# EAGLE design main (EAGLE 7.4.0)
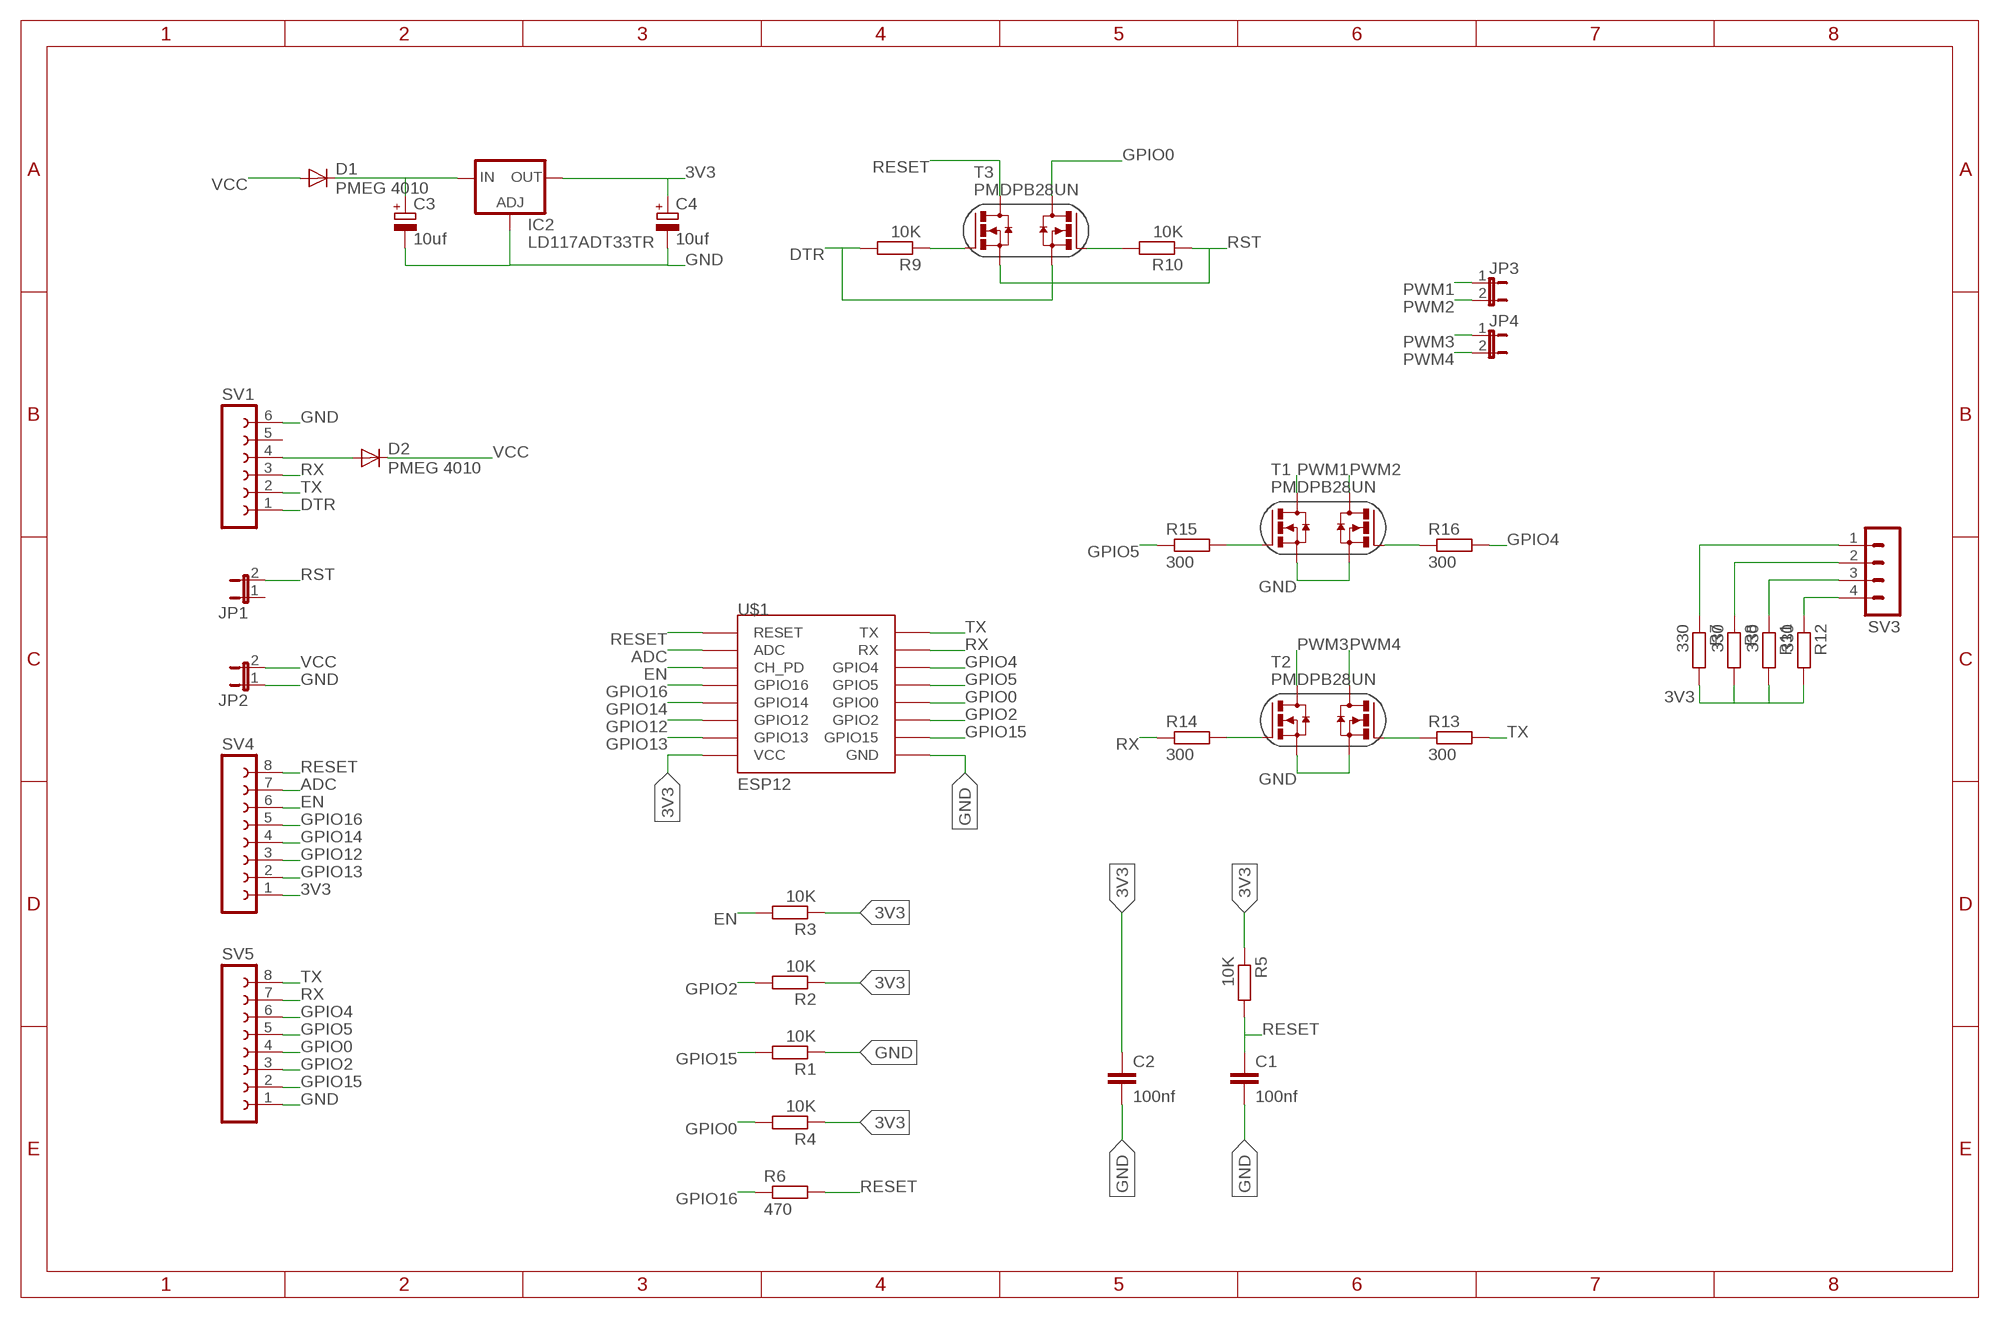
[diagram p0: schematic, sheet 1]

## Parts
C1  100nf  C-EUC0805K  [C0805K]
C2  100nf  C-EUC0805K  [C0805K]
C3  10uf  CPOL-EUSMCB  [SMC_B]
C4  10uf  CPOL-EUSMCB  [SMC_B]
D1  PMEG 4010  DIODESOD  [SOD-323]
D2  PMEG 4010  DIODESOD  [SOD-323]
IC2  LD117ADT33TR  [DPACK]
JP1  JUMPER-2PTH  [1X02]
JP2  JUMPER-2PTH  [1X02]
JP3  JUMPER-2PTH  [1X02]
JP4  JUMPER-2PTH  [1X02]
R1  10K  R-EU_R1206  [R1206]
R2  10K  R-EU_R1206  [R1206]
R3  10K  R-EU_R1206  [R1206]
R4  10K  R-EU_R1206  [R1206]
R5  10K  R-EU_R1206  [R1206]
R6  470  R-EU_R1206  [R1206]
R7  330  R-EU_R1206  [R1206]
R8  330  R-EU_R1206  [R1206]
R9  10K  R-EU_R1206  [R1206]
R10  10K  R-EU_R1206  [R1206]
R11  330  R-EU_R1206  [R1206]
R12  330  R-EU_R1206  [R1206]
R13  300  R-EU_R1206  [R1206]
R14  300  R-EU_R1206  [R1206]
R15  300  R-EU_R1206  [R1206]
R16  300  R-EU_R1206  [R1206]
SV1  FE06-1  [FE06]
SV3  MA04-1  [MA04-1]
SV4  FE08-1  [FE08]
SV5  FE08-1  [FE08]
T1  PMDPB28UN  [SOT1118]
T2  PMDPB28UN  [SOT1118]
T3  PMDPB28UN  [SOT1118]
U$1  ESP12  [ESP12]

## Nets
3V3: C2.1 C4.+ IC2.4(OUT) R2.1 R3.1 R4.1 R5.1 R7.2 R8.2 R11.2 R12.2 SV4.1 U$1.VCC
ADC: SV4.7 U$1.ADC
DTR: R9.2 SV1.1 T3.S2
EN: R3.2 SV4.6 U$1.CH_PD
GND: C1.2 C2.2 C3.- C4.- IC2.1(ADJ) JP2.1 R1.1 SV1.6 SV5.1 T1.S1 T1.S2 T2.S1 T2.S2 U$1.GND
GPIO0: R4.2 SV5.4 T3.D2 T3.D22(D2) U$1.GPIO0
GPIO2: R2.2 SV5.3 U$1.GPIO2
GPIO4: R16.2 SV5.6 U$1.GPIO4
GPIO5: R15.1 SV5.5 U$1.GPIO5
GPIO12: SV4.3 U$1.GPIO12
GPIO13: SV4.2 U$1.GPIO13
GPIO14: SV4.4 U$1.GPIO14
GPIO15: R1.2 SV5.2 U$1.GPIO15
GPIO16: R6.1 SV4.5 U$1.GPIO16
N$1: R15.2 T1.G1
N$2: R16.1 T1.G2
N$3: R9.1 T3.G1
N$4: R10.2 T3.G2
N$5: R14.2 T2.G1
N$6: R13.1 T2.G2
N$7: D2.2(A) SV1.4
N$11: R12.1 SV3.4
N$12: R11.1 SV3.3
N$13: R8.1 SV3.2
N$14: R7.1 SV3.1
PWM1: JP3.1 T1.D1 T1.D11(D1)
PWM2: JP3.2 T1.D2 T1.D22(D2)
PWM3: JP4.1 T2.D1 T2.D11(D1)
PWM4: JP4.2 T2.D2 T2.D22(D2)
RESET: C1.1 R5.2 R6.2 SV4.8 T3.D1 T3.D11(D1) U$1.RESET
RST: JP1.2 R10.1 T3.S1
RX: R14.1 SV1.3 SV5.7 U$1.RX
TX: R13.2 SV1.2 SV5.8 U$1.TX
VCC: C3.+ D1.1(C) D1.2(A) D2.1(C) IC2.3(IN) JP2.2
Unconnected: JP1.1 SV1.5

## Library data of the parts
C1 C2 = rcl:C-EU: CAPACITOR, European symbol
C3 C4 = rcl:CPOL-EU: POLARIZED CAPACITOR, European symbol
D1 D2 = SparkFun:DIODE: Diode These are standard reverse protection diodes and small signal diodes. SMA package can handle up to about 1A. SOD-323 can handle about 200mA. What the SOD-323 package when ordering, there are some mfgs out there that are 5-pin packages.
IC2 = v-reg:LD117A?*: Low drop fixed and adjustable positive voltage regulators 1 A Source: http://www.st.com/stonline/products/literature/ds/7194/ld1117axx.pdf
JP1-JP4 = SparkFun:JUMPER-2: Jumper Basic 0.1" spaced jumper. Use with breakaway headers.
R1-R16 = resistor:R-EU_: RESISTOR, European symbol
SV1 = con-lsta:FE06-1: FEMALE HEADER; OC_FARNELL: unknown; OC_NEWARK: unknown
SV3 = con-lstb:MA04-1: PIN HEADER; OC_FARNELL: unknown; OC_NEWARK: unknown
SV4 SV5 = con-lsta:FE08-1: FEMALE HEADER; OC_FARNELL: unknown; OC_NEWARK: unknown
T1-T3 = ArmiT Comps:PMDPB28UN: PMDPB28UN 20 V, dual N-channel Trench MOSFET Dual N-channel enhancement mode Field-Effect Transistor (FET) in a small and leadless ultra thin DFN2020-6 (SOT1118) Surface-Mounted Device (SMD) plastic package using Trench MOSFET technology.
U$1 = esp8266modules:ESP12: ESP8266 Wifi module 12

## Board
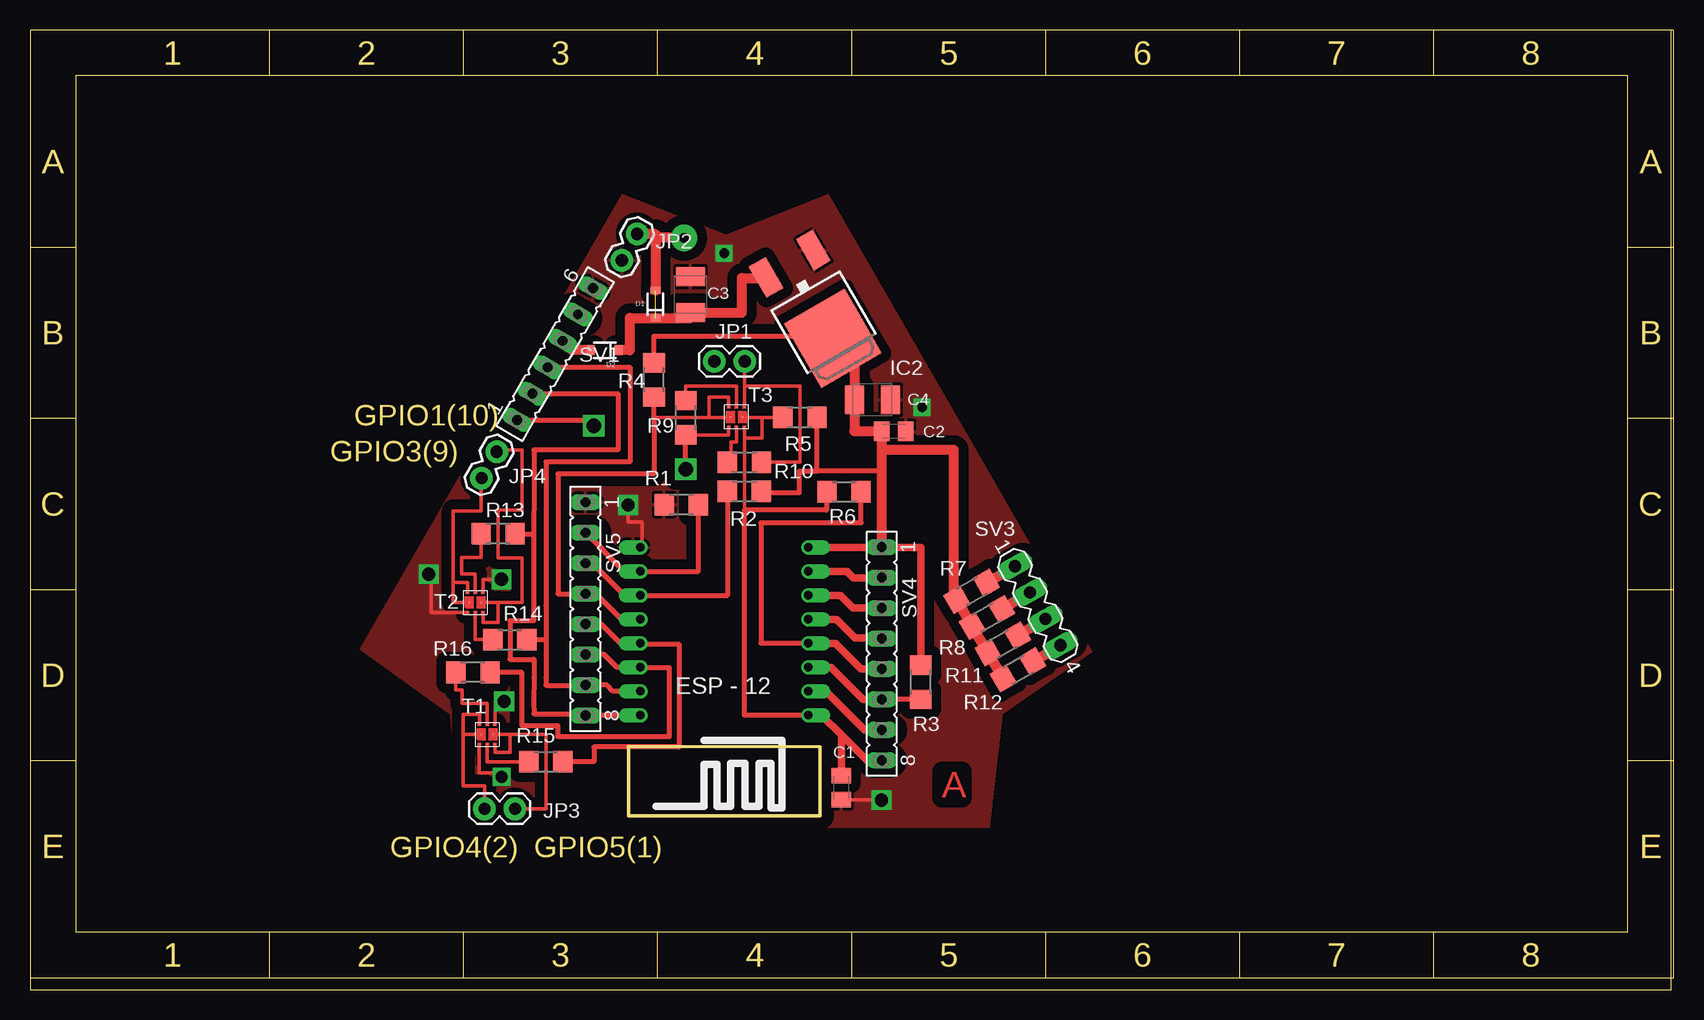
[diagram p1: board, top side]
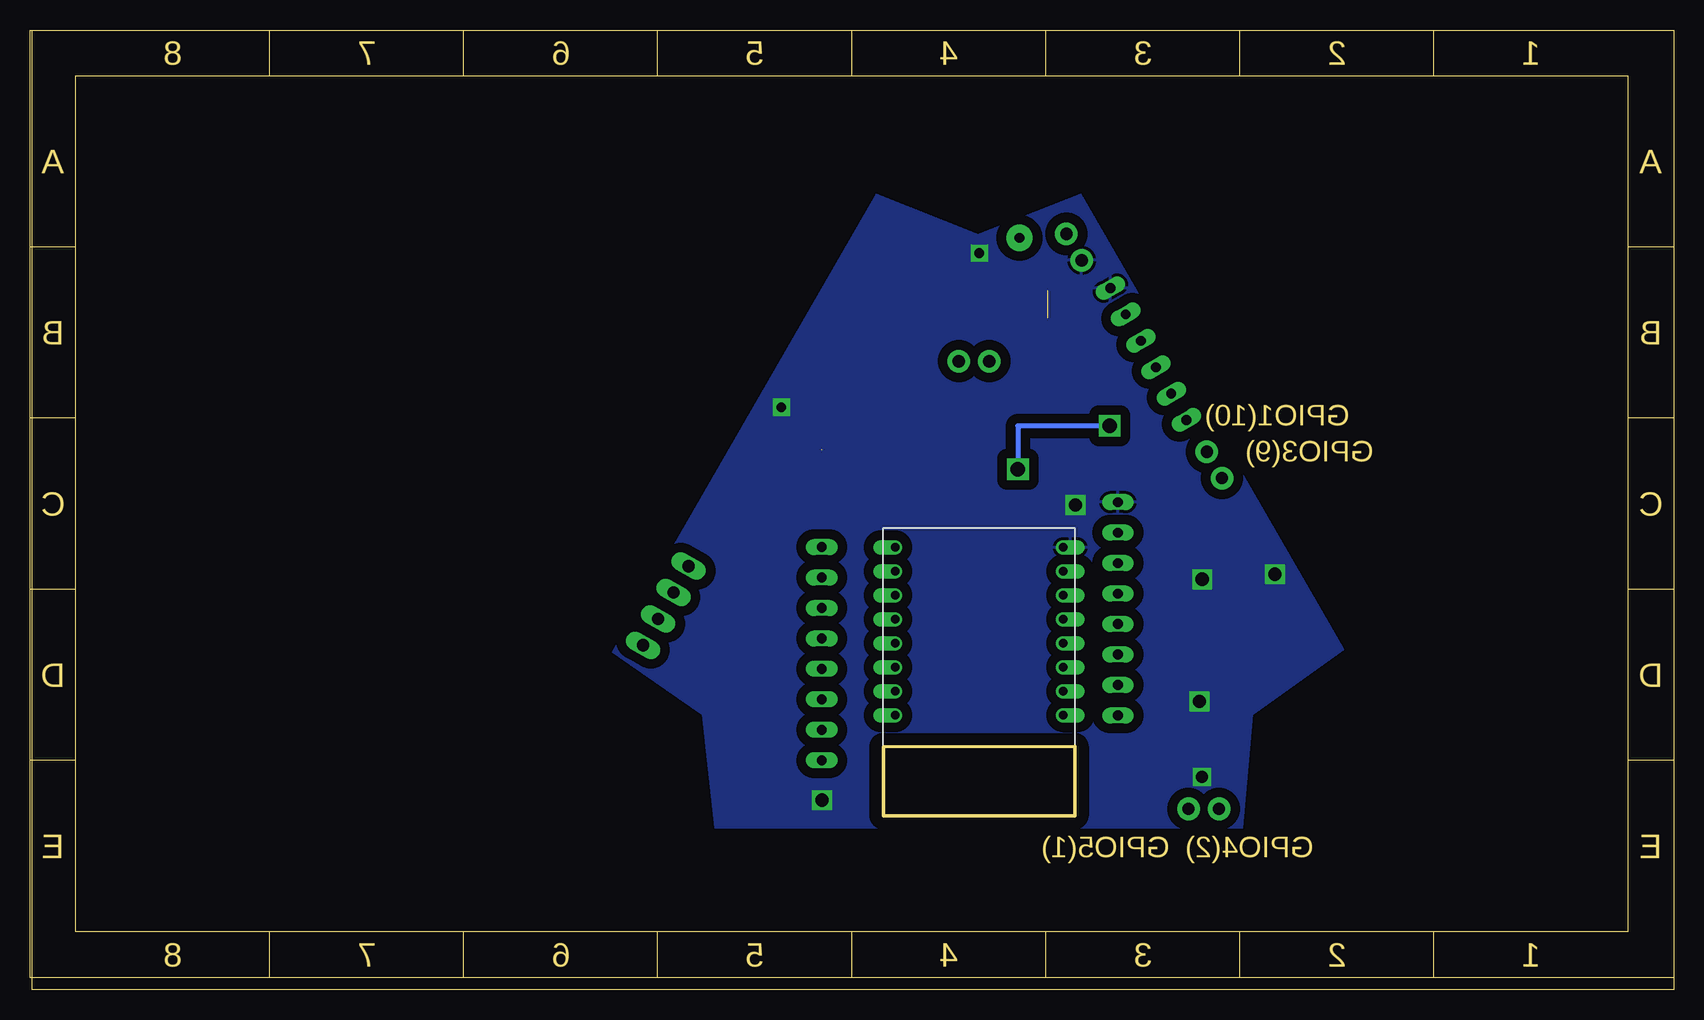
[diagram p2: board, bottom side, seen from below]

Size 137 x 80 mm. Coordinates in mm from the lower left corner, seen from the top.
Outline: 0,0 136.83,0 136.83,80 0,80 0,0
Copper layers (1*16): Top 0.035mm / dielectric 1.5mm / Bottom 0.035mm
Design rules "default": minimum track width 10mil, minimum drill 24mil, track to track 8mil, track to pad 8mil, pad to pad 8mil, via to via 8mil, smd to smd 8mil, copper to edge 40mil, drill to drill 8mil, minimum pad ring 10mil, minimum via ring 8mil, stop-mask expansion 4mil, vias tented up to drill 0mil, thermal gap 10mil

### Footprints (pad centres in the part's own frame; a part is rotated, then mirrored left to right if it is on the bottom)
C0805K = smd 1.3 x 1.6: 1 -1,0; 2 1,0
SMC_B = smd 1.6 x 2.4: + -1.5,0; - 1.5,0
SOD-323 = smd 0.63 x 0.83: 1 -1.15,0; 2 1.15,0
DPACK = smd 1.6 x 3: 1 -2.28,-4.8; 3 2.28,-4.8 | smd 5.8 x 6.2: 4 0,2.38
1X02 = drill 1.016 pad 1.88: 1 0,0; 2 2.54,0
R1206 = smd 1.6 x 1.803: 1 -1.422,0; 2 1.422,0
FE06 = drill 0.813 long: 1 -6.35,0; 2 -3.81,0; 3 -1.27,0; 4 1.27,0; 5 3.81,0; 6 6.35,0
MA04-1 = drill 1.016 long: 1 -3.81,0; 2 -1.27,0; 3 1.27,0; 4 3.81,0
FE08 = drill 0.813 long: 1 -8.89,0; 2 -6.35,0; 3 -3.81,0; 4 -1.27,0; 5 1.27,0; 6 3.81,0; 7 6.35,0; 8 8.89,0
SOT1118 = smd 0.127 x 0.076: D1 -0.546,1.105; D2 0.762,-0.572; D11 -0.386,0.279; D22 0.622,0.279; G1 0.102,-0.572; G2 0.102,1.118; S1 -0.546,-0.572; S2 0.762,1.105
ESP12 = drill 0.7 offset: ADC -7.1,3.8; CH_PD -7.1,1.8; GND 6.9,-8.2; GPIO0 6.9,-2.2; GPIO2 6.9,-4.2; GPIO4 6.9,1.8; GPIO5 6.9,-0.2; GPIO12 -7.1,-4.2; GPIO13 -7.1,-6.2; GPIO14 -7.1,-2.2; GPIO15 6.9,-6.2; GPIO16 -7.1,-0.2; RESET -7.1,5.8; RX 6.9,3.8; TX 6.9,5.8; VCC -7.1,-8.2

### Placement (x,y rotation side)
C1  67.63,16.83 270 top
C2  72.01,46.54 0 top
C3  55.07,57.94 90 top
C4  70.22,49.17 0 top
D1  52.14,57.14 90 top
D2  47.91,53.3 180 top
IC2  65.73,56.35 210 top
JP1  57.04,52.38 0 top
JP2  49.34,60.8 60 top
JP3  37.89,15.06 0 top
JP4  37.63,42.63 60 top
R1  54.29,40.43 0 top
R2  59.54,41.54 180 top
R3  74.26,25.62 270 top
R4  52.02,50.83 270 top
R5  64.18,47.7 180 top
R6  67.85,41.51 180 top
R7  78.5,33.2 210 top
R8  79.77,31.02 210 top
R9  54.66,47.68 270 top
R10  59.55,43.96 180 top
R11  81.08,28.81 210 top
R12  82.36,26.65 210 top
R13  39.02,38 0 top
R14  40,29.17 180 top
R15  43,19 180 top
R16  36.92,26.44 0 top
SV1  43.77,52.98 60 top
SV3  84,32 300 top
SV4  71,28 270 top
SV5  46.31,31.74 270 top
T1  38,21 0 top
T2  37,32 0 top
T3  59,48 180 top
U$1  57.79,28.66 180 top

### Tracks (layer width: path | path; a pad name or v marks a point on that pad's centre or on a via)
3V3  (1 unrouted)
  Top 0.406: R2.1 61.01,41.43 64.14,41.43 64.14,43.22 65.57,43.22 | R5.1 65.56,47.7 65.57,43.22 | SV4.1 71.01,43.22 65.57,43.22 | R4.1 52.02,54.47 66.92,54.47 IC2.4
  Top 0.61: U$1.VCC 70.97,36.86 SV4.1 71.01,36.87 74.26,36.87 R3.1 | R7.2 77,32.76
  Top 0.813: SV4.1 71,45 | R12.2 R11.2 R8.2 R7.2 | 77,32.76 77,45 71.01,45 | 71,45 71.01,45 | 71.01,45 C2.1 71.01,46.56 68.71,46.56 C4.+ 68.75,49.17 68.75,54.11 66.92,54.11 IC2.4
ADC
  Top 0.61: U$1.ADC 66.37,24.86 69.58,21.65 SV4.7
DTR  (via drill 1.2)
  Top 0.254: 55.3,46.6 54.02,46.6 R9.2
  Top 0.3: T3.S2 58.24,46.25 55.3,46.25 55.3,46.6
  Top 0.406: SV1.1 47,47.48 v47,47 | v54.65,43.39 v54.66,43.39 R9.2
  Bottom 0.406: v47,47 54.65,47 v54.65,43.39
EN
  Top 0.406: R3.2 SV4.6
  Top 0.61: U$1.CH_PD 66.76,26.86 69.43,24.19 SV4.6
GND  (via drill 0.8 pad 1.42, 1, 1.1)
  Top 0.3: T2.S2 37.76,34.2 v39.29,34.2 | T2.S1 33.45,31.43 33.45,34.57 33.22,34.57 v33.22,34.63 | T1.S2 38.76,24.02 39.2,24.02 v39.52,24.03 | T1.S1 37.45,18.06 39.49,18.06 v39.31,17.71 | U$1.GND 51,36.86 51,39 49.85,39 v49.85,40.4 | C1.2 70.98,15.83 v70.98,15.8
  other vias: 57.87,61.4 74.36,48.54
  pour Bottom (isolate 0.813): 35.9,13.5 35.05,22.95 27.5,28.35 49.4,66.3 58,62.95 66.5,66.3 88.5,28.15 81,22.95 79.95,13.5
  pour Top (isolate 0.813): 35.9,13.5 35.05,22.95 27.5,28.35 49.4,66.3 58,62.95 66.5,66.3 88.5,28.15 81,22.95 79.95,13.5
GPIO0
  Top 0.254: 58.36,47.7 T3.D22
  Top 0.3: T3.D2 58.24,49.4 56.6,49.4 56.6,47.7 | 58.36,47.7 56.6,47.7 | 56.6,47.7 51.99,47.7
  Top 0.406: R4.2 51.99,49.41 51.99,47.7 51.99,47.68 52,47.68 52,43 44,43 44,33 45.31,33 45.32,33.01 SV5.4 46.33,32.99 47.19,32.99 49.32,30.86 U$1.GPIO0
GPIO2
  Top 0.406: R2.2 58.13,32.86 U$1.GPIO2 49.57,32.86 46.9,35.53 46.33,35.53 SV5.3
GPIO4
  Top 0.406: SV5.6 47.86,27.93 48.93,26.86 U$1.GPIO4 53.28,26.85 53.28,21.08 44,21.08 44,22 41,22 41,26.43 R16.2
GPIO5
  Top 0.406: SV5.5 47.62,30.47 49.23,28.86 U$1.GPIO5 50.95,28.8 54.1,28.8 54.1,20.22 47,20.22 47,19 R15.1 44.42,19.69
GPIO12
  Top 0.61: U$1.GPIO12 67.55,32.86 68.61,31.8 SV4.3
GPIO13
  Top 0.61: U$1.GPIO13 68.12,34.86 68.65,34.33 70.98,34.33 SV4.2
GPIO14
  Top 0.61: U$1.GPIO14 67.22,30.86 68.78,29.3 70.97,29.3 SV4.4
GPIO15
  Top 0.406: R1.2 55.71,34.87 U$1.GPIO15 49.54,34.86 SV5.2
GPIO16
  Top 0.406: U$1.GPIO16 64.89,28.89 60.92,28.89 60.92,38.93 69.27,38.93 R6.1
  Top 0.61: U$1.GPIO16 67.15,28.86 69.28,26.73 SV4.5
N$1
  Top 0.3: T1.G1 38.11,19.43 38.11,19 R15.2
N$2
  Top 0.3: T1.G2 38.11,23.85 36,23.85 36,25 35.5,25 R16.1
N$3
  Top 0.254: 54.03,49.45 R9.1
  Top 0.3: 54.67,49.45 R9.1 54.65,50.33 58.89,50.33 T3.G1
N$4
  Top 0.254: 57.95,44.02 R10.2
  Top 0.3: T3.G2 58.89,45.64 58.43,45.63 58.43,44.57 58.13,44.57 R10.2
N$5
  Top 0.3: T2.G1 37.11,29.17 R14.2
N$6
  Top 0.3: R13.1 37.6,36.01 35.98,36.01 35.98,34.66 37.11,34.66 T2.G2
N$7
  Top 0.813: D2.2 45.19,53.3 SV1.4
N$11
  Top 0.813: R12.1 SV3.4
N$12
  Top 0.813: R11.1 SV3.3
N$13
  Top 0.813: R8.1 SV3.2
N$14
  Top 0.813: R7.1 SV3.1
PWM1
  Top 0.3: T1.D11 36.12,21.28 | 36.12,21.28 36.12,16.98 37.89,16.98 JP3.1 | T1.D1 37.46,22.95 36.12,22.95 36.12,21.28
PWM2
  Top 0.3: T1.D22 40.01,21.28 | 40.01,21.28 43.03,21.28 43.03,15.06 JP3.2 | T1.D2 38.76,19.78 40.01,19.78 40.01,21.28
PWM3
  Top 0.3: T2.D11 35.28,32.28 35.28,33.94 35.28,33.95 | 35.28,33.95 35.28,39.9 37.62,39.9 JP4.1 | T2.D1 36.46,33.95 35.28,33.95
PWM4
  Top 0.3: JP4.2 38.9,45 41,45 41,40 39,40 39,36 41,36 41,32.28 39.03,32.28 | T2.D22 39.03,32.28 | T2.D2 37.76,30.62 39.03,30.62 39.03,32.28
RESET
  Top 0.254: 59.41,47.7 T3.D11
  Top 0.3: 59.41,47.7 61,47.7 | 61,47.7 61,46 59.55,46 | 59.55,46 T3.D1 | 59.55,46 59.55,39.72 59.55,39.58 | R5.2 61,47.7
  Top 0.406: 59.55,39.62 59.55,39.58 59.55,22.86 U$1.RESET | R6.2 66.38,41.51 66.38,39.96 59.55,39.96 59.55,39.72
  Top 0.61: U$1.RESET 65.98,22.86 67.63,21.21 | 67.63,21.21 69.75,19.09 70.98,19.09 SV4.8 | C1.1 67.63,21.21
RST
  Top 0.3: T3.S1 59.55,50.32 | 59.55,50.32 59.55,52.21 59.53,52.21 JP1.2 | 59.55,50.32 64.2,50.32 64.2,43.98 60.97,43.98 R10.1
RX
  Top 0.406: 43,26 43.01,31.99 43,44 50,44 50,51.88 SV1.3 | 43,26 43,25.37 45.31,25.37 SV5.7 48.09,25.39 48.62,24.86 U$1.RX | R14.1 43,29.17 43,26
TX
  Top 0.3: 41.99,34.89 41.99,34.87
  Top 0.406: 41.99,34 41.99,34.87 42,45 49,45 49,49.68 SV1.2 | 41.99,34 41.99,32.9 41.99,30.74 39.99,30.74 40,30.74 40,27.54 42,27.54 42,26 42,24 42,23 45.31,23 SV5.8 U$1.TX | R13.2 41.99,38 41.99,34
VCC  (via drill 0.8 pad 2.18)  (1 unrouted)
  Top 0.813: D1.2 52.17,58.29 52.17,62.67 | JP2.2 50.68,62.97 52.17,62.97 52.17,62.67 | IC2.3 61.35,59.33 59.34,59.33 59.34,56.44 C3.+ 55.07,55.99 D1.1 50,56 50,53.31 D2.1 | v54.52,62.67 52.17,62.67

### Text on the board
Top: A
Dimension: GPIO1(10) | GPIO3(9) | GPIO4(2) | GPIO5(1)